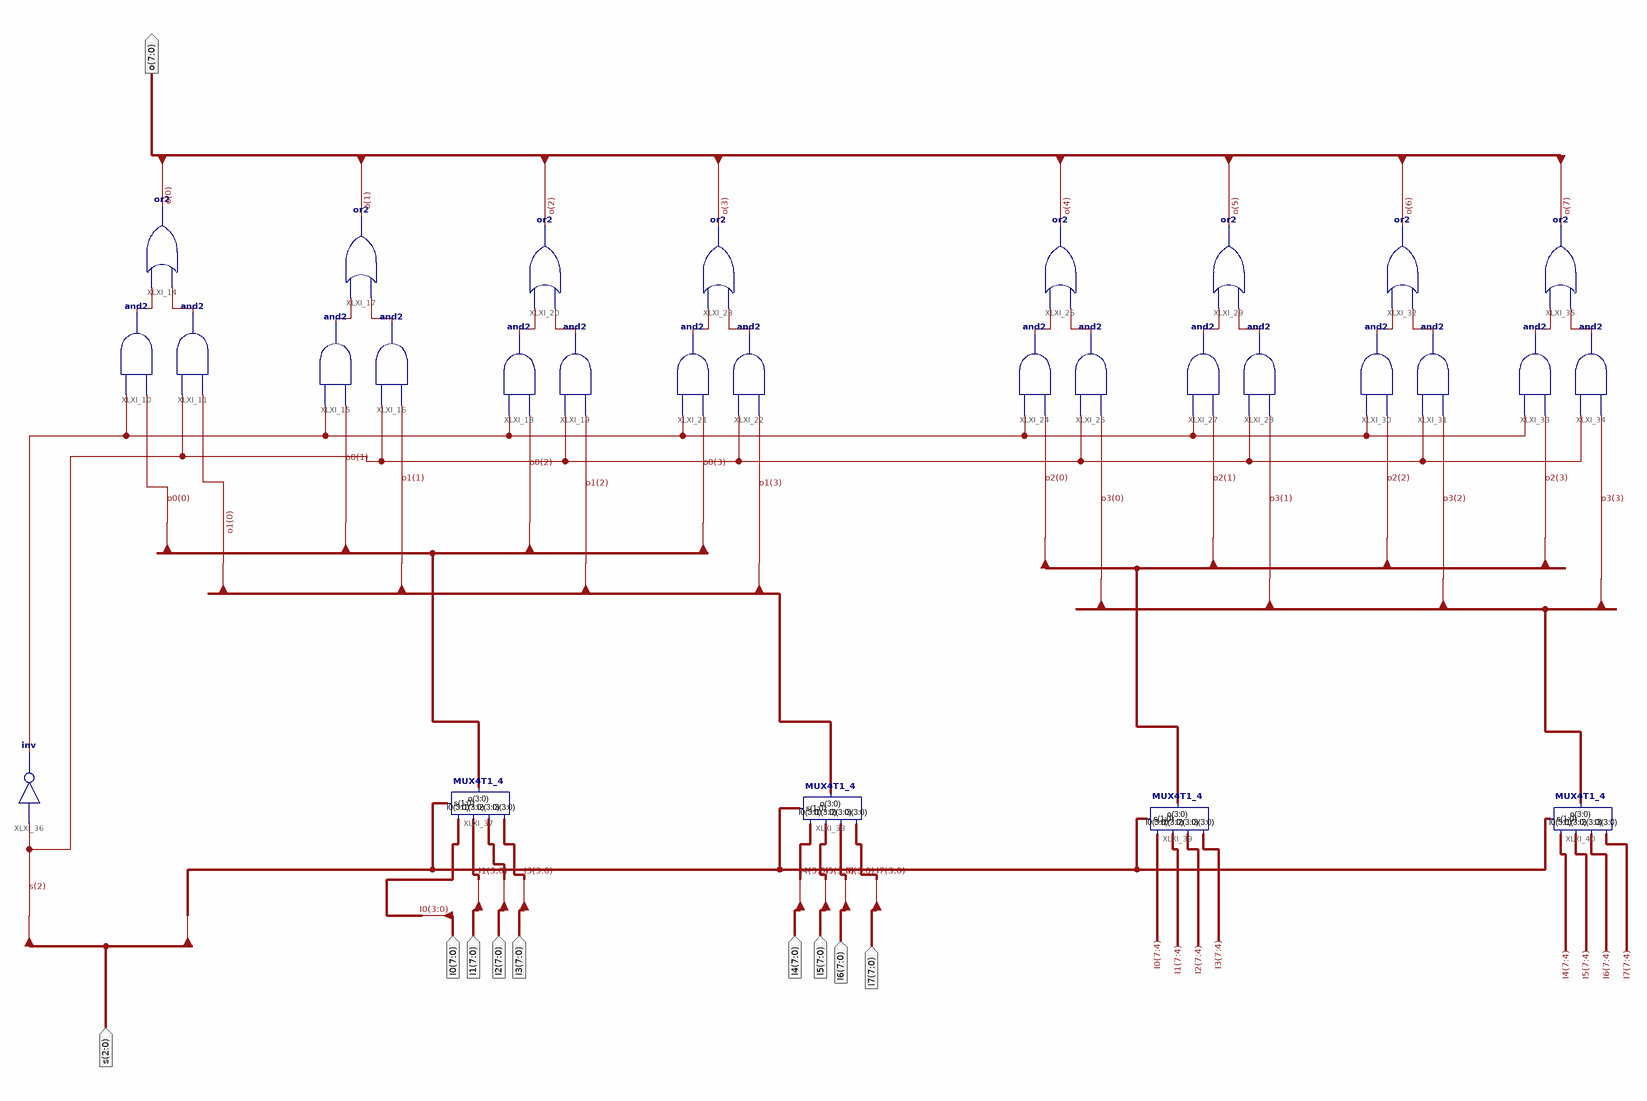
[diagram p0: schematic sheet 1]
// Xilinx ISE schematic MUX8T1_8.sch (kintex7) as structural Verilog: 29 symbols, 10 ports
module MUX8T1_8 (
  input  [2:0] s,
  input  [7:0] I0,
  input  [7:0] I1,
  input  [7:0] I2,
  input  [7:0] I3,
  input  [7:0] I4,
  input  [7:0] I5,
  input  [7:0] I6,
  input  [7:0] I7,
  output [7:0] o
);

  wire XLXN_33, XLXN_34, XLXN_39, XLXN_40, XLXN_41, XLXN_42, XLXN_43, XLXN_44, XLXN_45, XLXN_46, XLXN_47,
       XLXN_48, XLXN_49, XLXN_50, XLXN_51, XLXN_52, XLXN_108;
  wire [3:0] o0, o1, o2, o3;

  and XLXI_10 (XLXN_33, o0[0], XLXN_108);
  and XLXI_11 (XLXN_34, o1[0], s[2]);
  or XLXI_14 (o[0], XLXN_34, XLXN_33);
  and XLXI_15 (XLXN_40, o0[1], XLXN_108);
  and XLXI_16 (XLXN_39, o1[1], s[2]);
  or XLXI_17 (o[1], XLXN_39, XLXN_40);
  and XLXI_18 (XLXN_42, o0[2], XLXN_108);
  and XLXI_19 (XLXN_41, o1[2], s[2]);
  or XLXI_20 (o[2], XLXN_41, XLXN_42);
  and XLXI_21 (XLXN_44, o0[3], XLXN_108);
  and XLXI_22 (XLXN_43, o1[3], s[2]);
  or XLXI_23 (o[3], XLXN_43, XLXN_44);
  not XLXI_36 (XLXN_108, s[2]);
  and XLXI_24 (XLXN_46, o2[0], XLXN_108);
  and XLXI_25 (XLXN_45, o3[0], s[2]);
  or XLXI_26 (o[4], XLXN_45, XLXN_46);
  and XLXI_27 (XLXN_48, o2[1], XLXN_108);
  and XLXI_28 (XLXN_47, o3[1], s[2]);
  or XLXI_29 (o[5], XLXN_47, XLXN_48);
  and XLXI_30 (XLXN_50, o2[2], XLXN_108);
  and XLXI_31 (XLXN_49, o3[2], s[2]);
  or XLXI_32 (o[6], XLXN_49, XLXN_50);
  and XLXI_33 (XLXN_52, o2[3], XLXN_108);
  and XLXI_34 (XLXN_51, o3[3], s[2]);
  or XLXI_35 (o[7], XLXN_51, XLXN_52);
  MUX4T1_4 XLXI_37 (.I3(I3[3:0]), .I2(I2[3:0]), .I1(I1[3:0]), .I0(I0[3:0]), .s(s[1:0]), .o(o0));
  MUX4T1_4 XLXI_38 (.I3(I7[3:0]), .I2(I6[3:0]), .I1(I5[3:0]), .I0(I4[3:0]), .s(s[1:0]), .o(o1));
  MUX4T1_4 XLXI_39 (.I3(I3[7:4]), .I2(I2[7:4]), .I1(I1[7:4]), .I0(I0[7:4]), .s(s[1:0]), .o(o2));
  MUX4T1_4 XLXI_40 (.I3(I7[7:4]), .I2(I6[7:4]), .I1(I5[7:4]), .I0(I4[7:4]), .s(s[1:0]), .o(o3));
endmodule
